# EAGLE schematic esp32-nbiot-xx-v12-wroom32 (EAGLE 7.3.0)
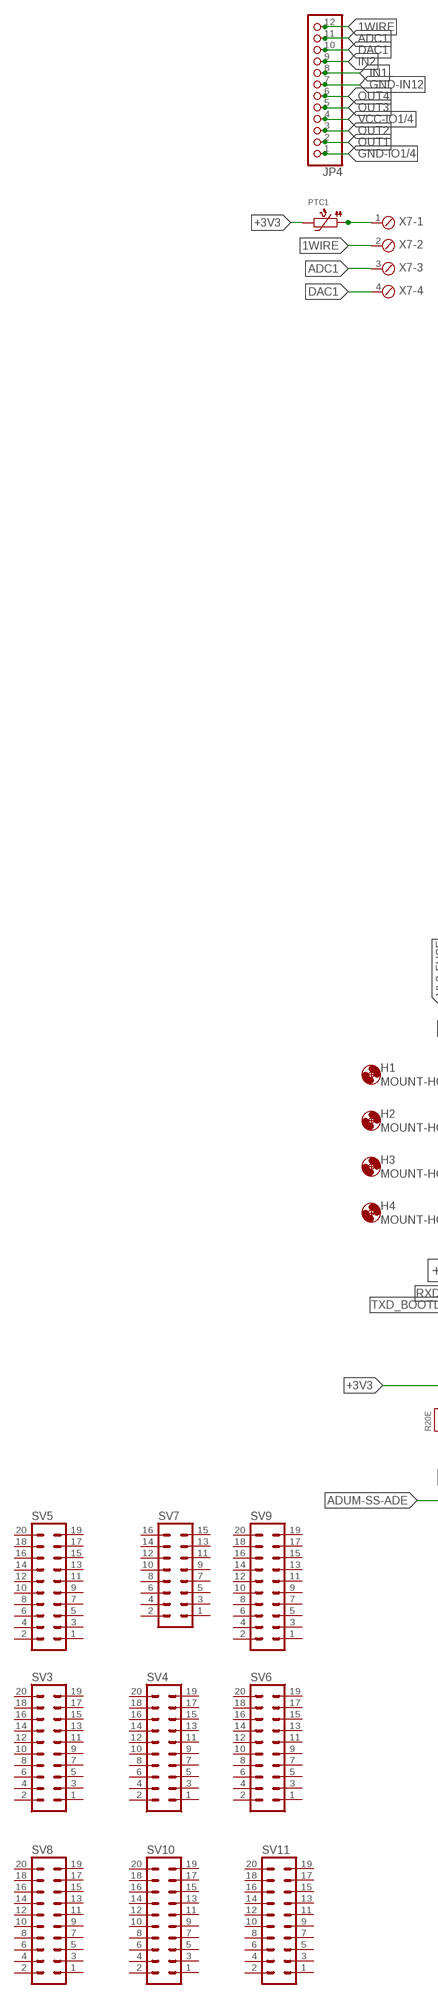
[diagram p0: schematic, sheet 1, part 1 of 3]
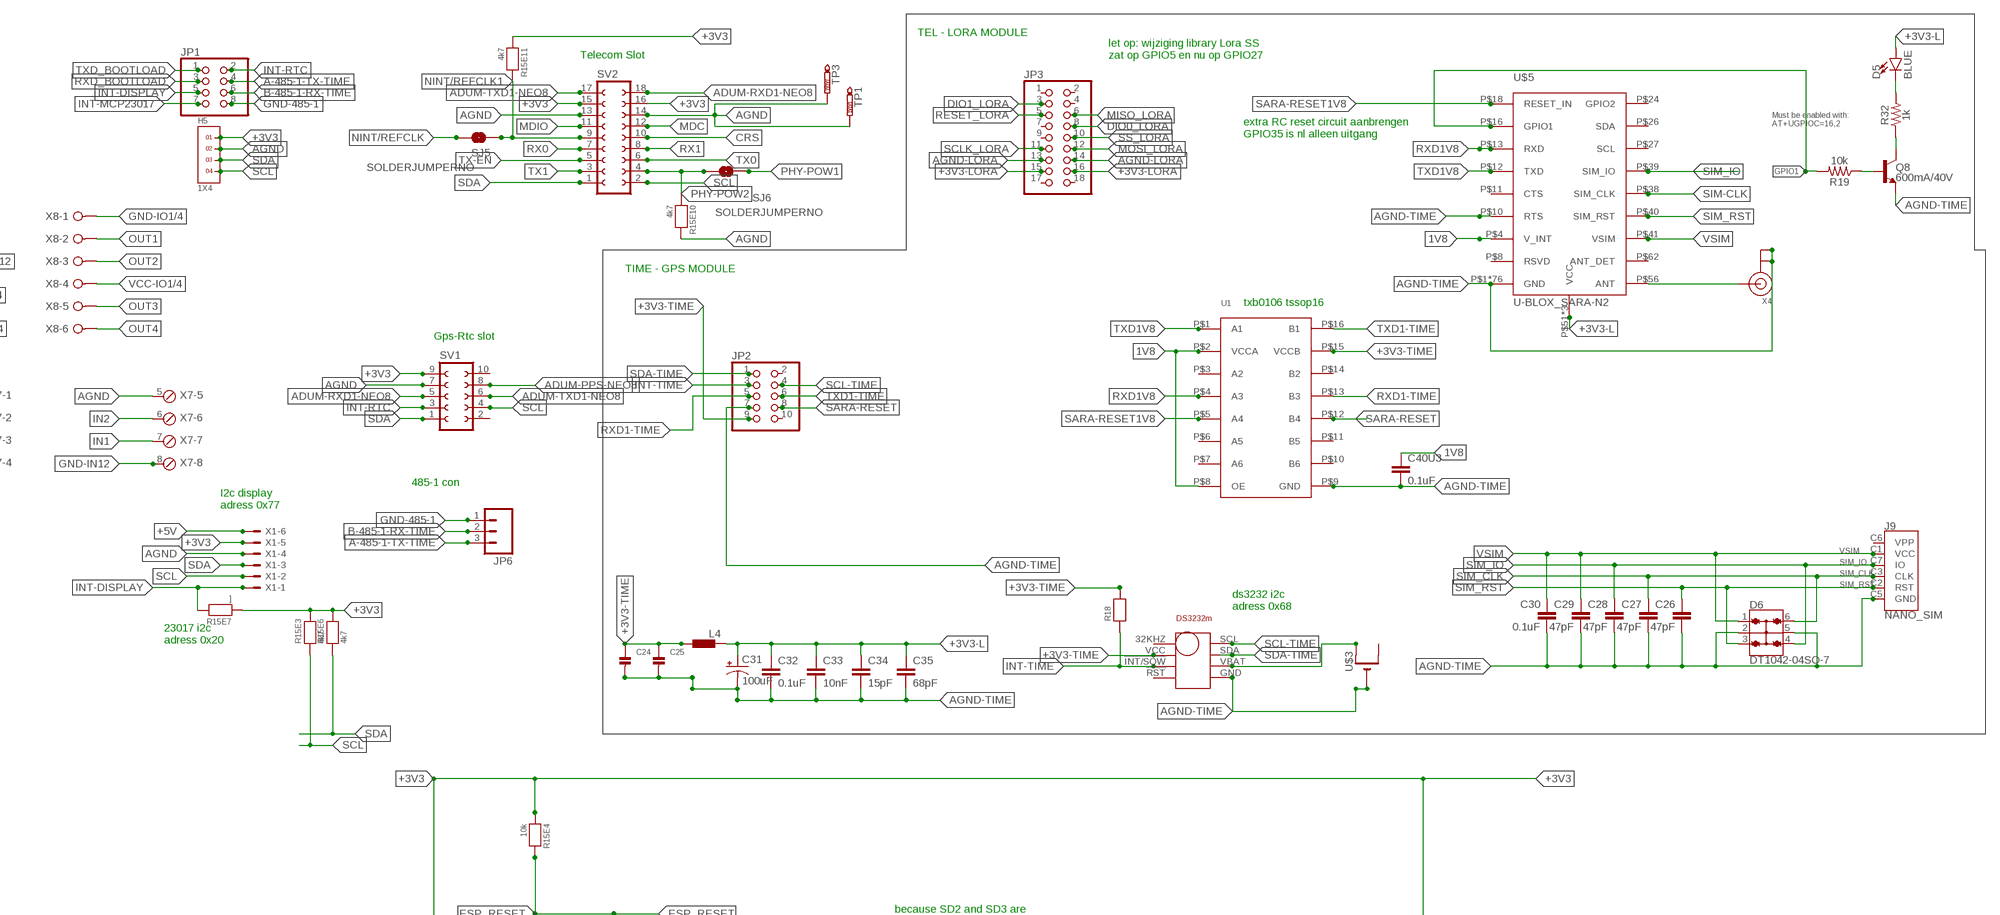
[diagram p1: schematic, sheet 1, part 2 of 3]
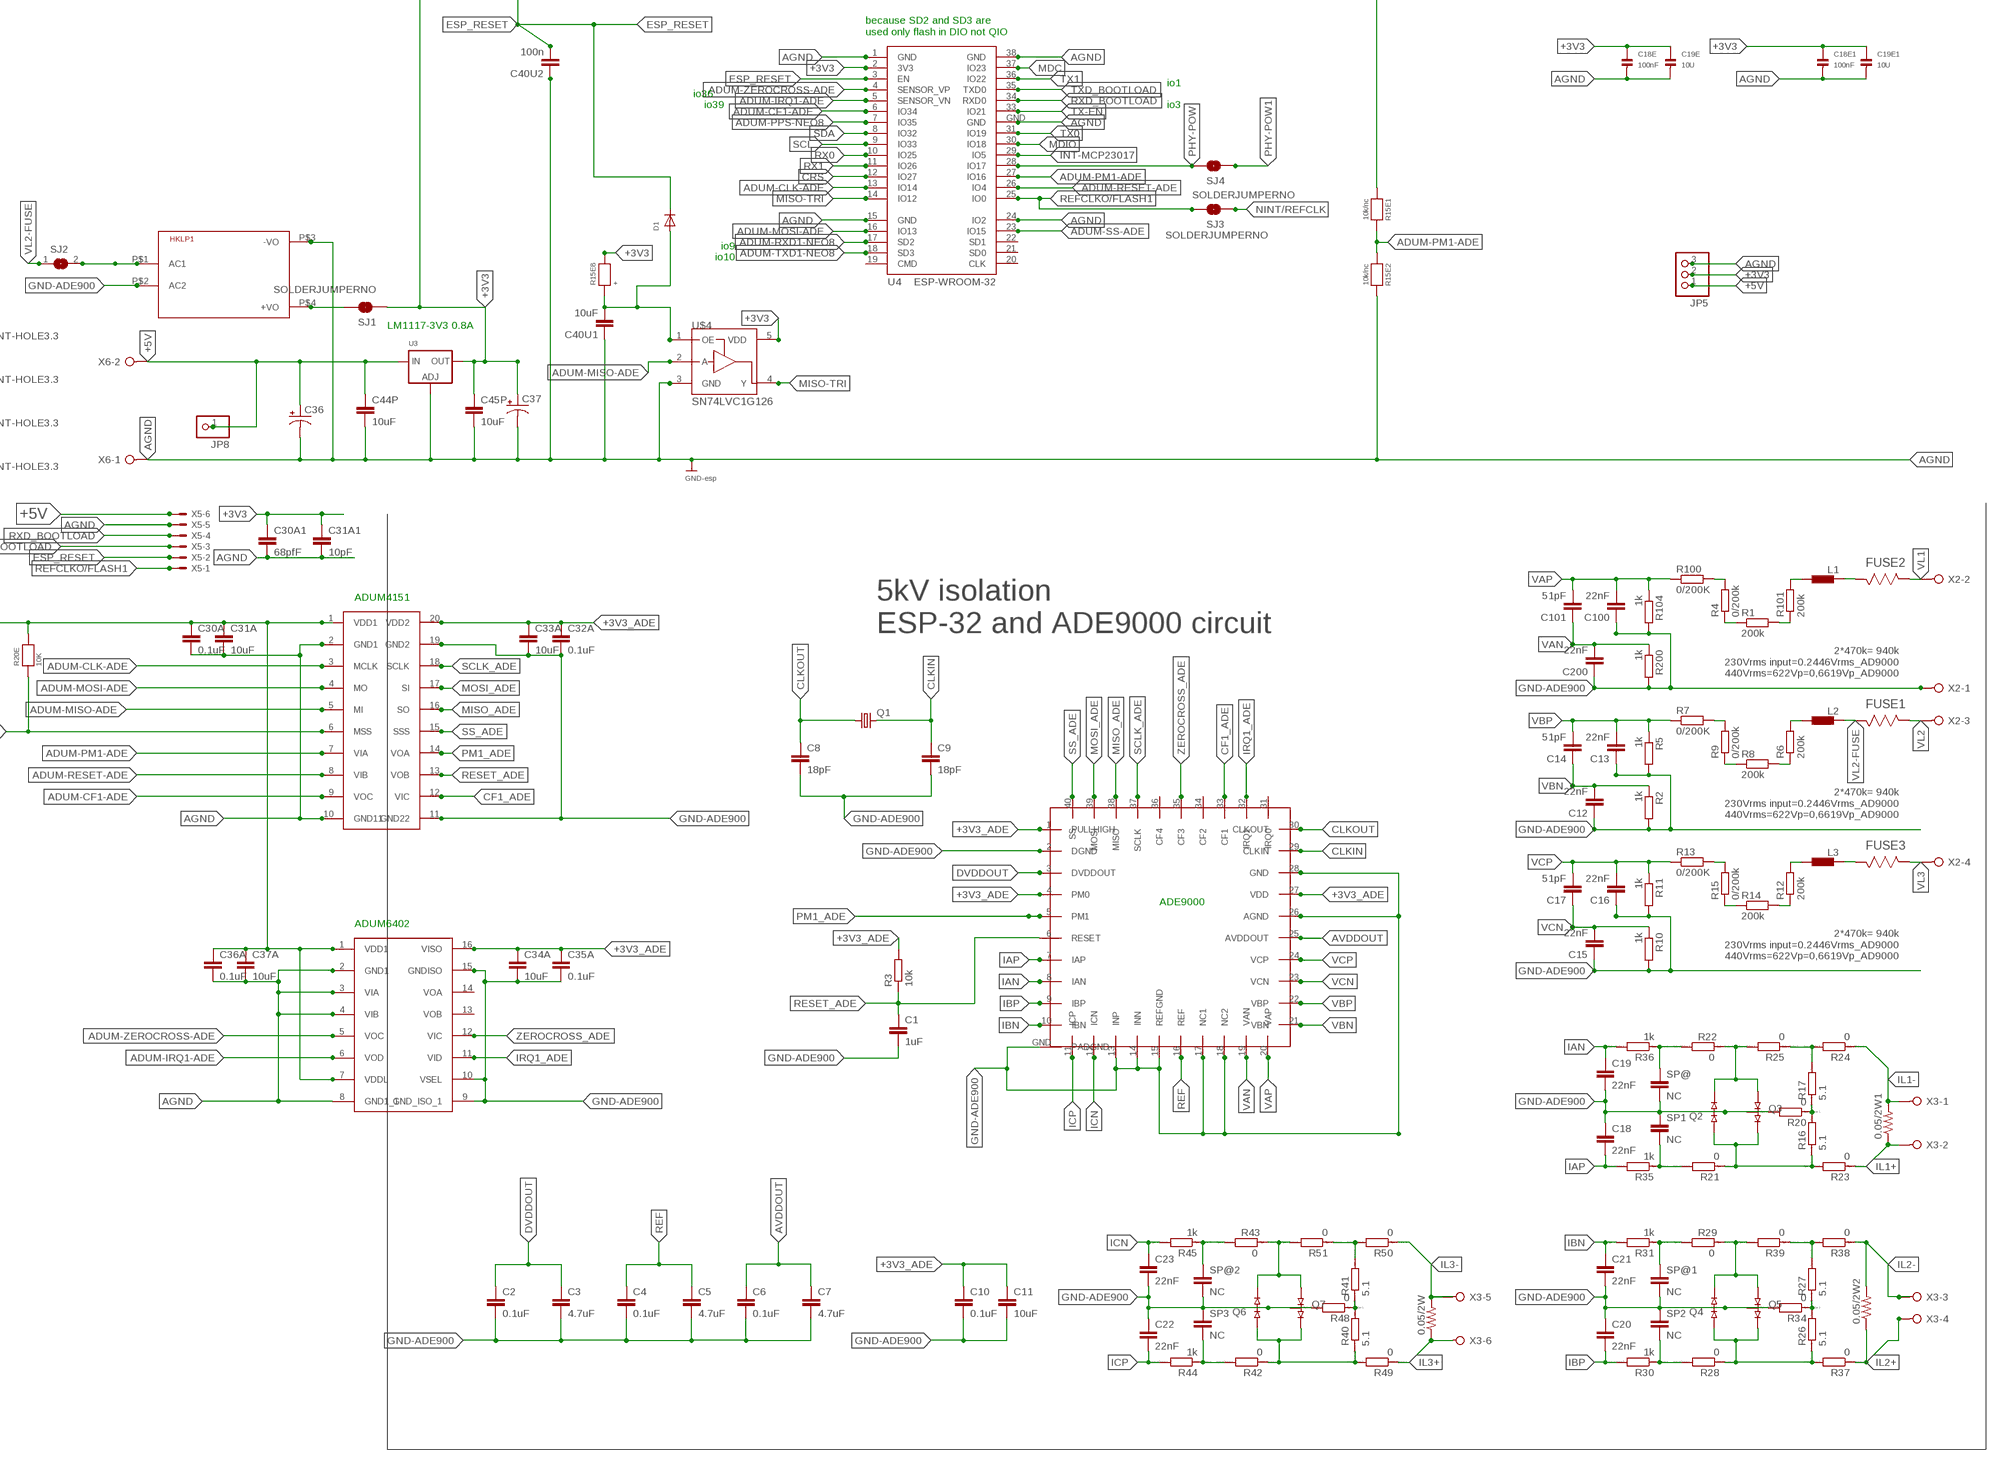
[diagram p2: schematic, sheet 1, part 3 of 3]

## Parts
0.05/2W  R-US_R4527  [R4527]
0.05/2W1  R-US_R4527  [R4527]
0.05/2W2  R-US_R4527  [R4527]
ADE9000  ADE9000  [LFCSP40]
ADUM4151  ADUM4151  [SOIC20R]
ADUM6402-2  ADUM6402  [SOIC16R]
C1  1uF  C-EUC0805  [C0805]
C2  0.1uF  C-EUC0805  [C0805]
C3  4.7uF  C-EUC0805  [C0805]
C4  0.1uF  C-EUC0805  [C0805]
C5  4.7uF  C-EUC0805  [C0805]
C6  0.1uF  C-EUC0805  [C0805]
C7  4.7uF  C-EUC0805  [C0805]
C8  18pF  C-EUC0805  [C0805]
C9  18pF  C-EUC0805  [C0805]
C10  0.1uF  C-EUC0805  [C0805]
C11  10uF  C-EUC0805  [C0805]
C12  22nF  C-EUC0805  [C0805]
C13  22nF  C-EUC0805  [C0805]
C14  51pF  C-EUC0805  [C0805]
C15  22nF  C-EUC0805  [C0805]
C16  22nF  C-EUC0805  [C0805]
C17  51pF  C-EUC0805  [C0805]
C18  22nF  C-EUC0805  [C0805]
C18E  100nF  CAP_CERAMIC_0805  [_0805]
C18E1  100nF  CAP_CERAMIC_0805  [_0805]
C19  22nF  C-EUC0805  [C0805]
C19E  10U  CAP_CERAMIC_0805  [_0805]
C19E1  10U  CAP_CERAMIC_0805  [_0805]
C20  22nF  C-EUC0805  [C0805]
C21  22nF  C-EUC0805  [C0805]
C22  22nF  C-EUC0805  [C0805]
C23  22nF  C-EUC0805  [C0805]
C24  CAP_CERAMIC0805  [0805]
C25  CAP_CERAMIC0805  [0805]
C26  47pF  47PF-0603-50V-5%  [0603]
C27  47pF  47PF-0603-50V-5%  [0603]
C28  47pF  47PF-0603-50V-5%  [0603]
C29  47pF  47PF-0603-50V-5%  [0603]
C30  0.1uF  0.1UF-0603-25V-(+80/-20%)  [0603]
C30A  0.1uF  C-EUC0805  [C0805]
C30A1  68pfF  C-EUC0805  [C0805]
C31  100uF  100UF-POLAR-1206-6.3V-20%  [1206-POLAR]
C31A  10uF  C-EUC0805  [C0805]
C31A1  10pF  C-EUC0805  [C0805]
C32  0.1uF  0.1UF-0603-25V-(+80/-20%)  [0603]
C32A  0.1uF  C-EUC0805  [C0805]
C33  10nF  10NF-0603-50V-10%  [0603]
C33A  10uF  C-EUC0805  [C0805]
C34  15pF  15PF-0603-50V-5%  [0603]
C34A  10uF  C-EUC0805  [C0805]
C35  68pF  68PF-0603-50V-5%  [0603]
C35A  0.1uF  C-EUC0805  [C0805]
C36  CPOL-USD/7343-31R  [D/7343-31R]
C36A  0.1uF  C-EUC0805  [C0805]
C37  CPOL-USD/7343-31R  [D/7343-31R]
C37A  10uF  C-EUC0805  [C0805]
C40U1  10uF  C-EUC0805  [C0805]
C40U2  100n  C-EUC0805  [C0805]
C40U3  0.1uF  C-EUC0805  [C0805]
C44P  10uF  C-EUC0805  [C0805]
C45P  10uF  C-EUC0805  [C0805]
C100  22nF  C-EUC0805  [C0805]
C101  51pF  C-EUC0805  [C0805]
C200  22nF  C-EUC0805  [C0805]
D1  DIODE_SOD-123FL  [SOD-123FL]
D5  BLUE  LED-BLUE0603  [LED-0603]
D6  DT1042-04SO-7  TVS_DIODE_ARRAY_4DT1042-04SO-7  [SOT23-6L]
FUSE1  CRCW25124R70JNEG  [RESC6332X71N]
FUSE2  CRCW25124R70JNEG  [RESC6332X71N]
FUSE3  CRCW25124R70JNEG  [RESC6332X71N]
H1  MOUNT-HOLE3.3  [3,3]
H2  MOUNT-HOLE3.3  [3,3]
H3  MOUNT-HOLE3.3  [3,3]
H4  MOUNT-HOLE3.3  [3,3]
H5  1X4  [1X4]
HKLP1  HKLPM01  [HKLPM01]
J9  NANO_SIM  NANO_SIMWURTH  [NANO_SIM_WURTH_693043020611]
JP1  PINHD-2X4  [2X04]
JP2  PINHD-2X5/90  [2X05/90]
JP3  PINHD-2X9/90  [2X09/90]
JP4  PINHD-1X12  [1X12]
JP5  PINHD-1X3  [1X03]
JP6  M03SCREW  [SCREWTERMINAL-3.5MM-3]
JP8  PINHD-1X1  [1X01]
L1  1500  FERRITE_BEAD0805  [M0805]
L2  1500  FERRITE_BEAD0805  [M0805]
L3  1500  FERRITE_BEAD0805  [M0805]
L4  1500  FERRITE_BEAD0805  [M0805]
PTC1  PTC1206  [1206]
Q1  CRYSTALCTS406  [CTS406]
Q2  MMBD4148SE  DUAL_DIODE_SOT23-3  [SOT23-3]
Q3  MMBD4148SE  DUAL_DIODE_SOT23-3  [SOT23-3]
Q4  MMBD4148SE  DUAL_DIODE_SOT23-3  [SOT23-3]
Q5  MMBD4148SE  DUAL_DIODE_SOT23-3  [SOT23-3]
Q6  MMBD4148SE  DUAL_DIODE_SOT23-3  [SOT23-3]
Q7  MMBD4148SE  DUAL_DIODE_SOT23-3  [SOT23-3]
Q8  600mA/40V  TRANS_NPN-MMBT2222AL  [SOT23-3]
R1  200k  R-EU_M1206  [M1206]
R2  1k  R-EU_M0805  [M0805]
R3  10k  R-EU_M0805  [M0805]
R4  0/200k  R-EU_M1206  [M1206]
R5  1k  R-EU_M0805  [M0805]
R6  200k  R-EU_M1206  [M1206]
R7  0/200K  R-EU_M1206  [M1206]
R8  200k  R-EU_M1206  [M1206]
R9  0/200k  R-EU_M1206  [M1206]
R10  1k  R-EU_M0805  [M0805]
R11  1k  R-EU_M0805  [M0805]
R12  200k  R-EU_M1206  [M1206]
R13  0/200K  R-EU_M1206  [M1206]
R14  200k  R-EU_M1206  [M1206]
R15  0/200k  R-EU_M1206  [M1206]
R15E1  10k/nc  RESISTOR_0805  [_0805]
R15E2  10k/nc  RESISTOR_0805  [_0805]
R15E3  4k7  RESISTOR_0805  [_0805]
R15E4  10k  RESISTOR_0805  [_0805]
R15E6  4k7  RESISTOR_0805  [_0805]
R15E7  ]  RESISTOR_0805  [_0805]
R15E8  +  RESISTOR_0805  [_0805]
R15E10  4k7  RESISTOR_0805  [_0805]
R15E11  4k7  RESISTOR_0805  [_0805]
R16  5.1  R  [R0805]
R17  5.1  R  [R0805]
R18  RESISTOR0805  [0805]
R19  10k  10KOHM-0603-1/10W-1%  [0603]
R20  0  RR0603  [R0603]
R20E  10K  RESISTOR_0805  [_0805]
R21  0  RR0603  [R0603]
R22  0  RR0603  [R0603]
R23  0  RR0603  [R0603]
R24  0  RR0603  [R0603]
R25  0  RR0603  [R0603]
R26  5.1  R  [R0805]
R27  5.1  R  [R0805]
R28  0  RR0603  [R0603]
R29  0  RR0603  [R0603]
R30  1k  RR0603  [R0603]
R31  1k  RR0603  [R0603]
R32  1k  1KOHM-0603-1/10W-1%  [0603]
R34  0  RR0603  [R0603]
R35  1k  RR0603  [R0603]
R36  1k  RR0603  [R0603]
R37  0  RR0603  [R0603]
R38  0  RR0603  [R0603]
R39  0  RR0603  [R0603]
R40  5.1  R  [R0805]
R41  5.1  R  [R0805]
R42  0  RR0603  [R0603]
R43  0  RR0603  [R0603]
R44  1k  RR0603  [R0603]
R45  1k  RR0603  [R0603]
R48  0  RR0603  [R0603]
R49  0  RR0603  [R0603]
R50  0  RR0603  [R0603]
R51  0  RR0603  [R0603]
R100  0/200K  R-EU_M1206  [M1206]
R101  200k  R-EU_M1206  [M1206]
R104  1k  R-EU_M0805  [M0805]
R200  1k  R-EU_M0805  [M0805]
SJ1  SOLDERJUMPERNO  [SJ_2S-NO]
SJ2  SOLDERJUMPERWAVE  [SOLDERJUMPER_WAVE]
SJ3  SOLDERJUMPERNO  [SJ_2S-NO]
SJ4  SOLDERJUMPERNO  [SJ_2S-NO]
SJ5  SOLDERJUMPERNO  [SJ_2S-NO]
SJ6  SOLDERJUMPERNO  [SJ_2S-NO]
SP1  NC  C-EUC0805  [C0805]
SP2  NC  C-EUC0805  [C0805]
SP3  NC  C-EUC0805  [C0805]
SP@  NC  C-EUC0805  [C0805]
SP@1  NC  C-EUC0805  [C0805]
SP@2  NC  C-EUC0805  [C0805]
SV1  FE05-2W  [FE05-2W]
SV2  FE09-2W  [FE09-2W]
SV3  MA10-2  [MA10-2]
SV4  MA10-2  [MA10-2]
SV5  MA10-2  [MA10-2]
SV6  MA10-2  [MA10-2]
SV7  MA08-2  [MA08-2]
SV8  MA10-2  [MA10-2]
SV9  MA10-2  [MA10-2]
SV10  MA10-2  [MA10-2]
SV11  MA10-2  [MA10-2]
TP1  PTR1TP08SQ  [TP08SQ]
TP3  PTR1TP08SQ  [TP08SQ]
U1  TXB0106  [TSSOP16]
U3  LM1117SOT223-REFLOW  [SOT223-R]
U4  ESP-WROOM-32  [ESP-WROOM-32]
U$1  DS3232M  [SOIC8]
U$3  CR1220SMT  [CR1220-SMD]
U$4  SN74LVC1G126DBVT  [SOT-23-5L]
U$5  U-BLOX_SARA-N2  [SARA-N2]
X1  22-23-2061  [22-23-2061]
X2  W237-04P  [W237-4P]
X3  W237-06P  [W237-6P]
X4  ANTENNA_U.FL  [U.FL]
X5  22-23-2061  [22-23-2061]
X6  W237-02P  [W237-132]
X7  MPT8  [8POL254]
X8  W237-06P  [W237-6P]

## Nets
1V8: C40U3.1 U1.P$2(VCCA) U1.P$8(OE) U$5.P$4(V_INT)
1WIRE: JP4.12 X7.2
+3V3: ADUM4151.1(VDD1) ADUM6402-2.1(VDD1) ADUM6402-2.7(VDDL) C18E1.1 C18E.1 C19E1.1 C19E.1 C30A1.1 C30A.1 C31A1.1 C31A.1 C36A.1 C37.+ C37A.1 C45P.1 H5.1 JP5.2 PTC1.2 R15E1.1 R15E3.2 R15E4.1 R15E6.2 R15E7.1 R15E8.2 R15E11.1 R20E.2 SJ1.1 SV1.9 SV2.15 SV2.16 U3.2(OUT) U4.2(3V3) U$4.5(VDD) X1.5
+3V3-L: C31.1(+) C32.1 C33.1 C34.1 C35.1 D5.A L4.1 U$5.P$51(VCC) U$5.P$52(VCC) U$5.P$53(VCC)
+3V3-LORA: JP3.15 JP3.16
+3V3-TIME: C24.1 C25.1 JP2.9 L4.2 R18.2 U1.P$15(VCCB) U$1.VCC
+3V3_ADE: ADE9000.1(PULLHIGH) ADE9000.4(PM0) ADE9000.27(VDD) ADUM4151.20(VDD2) ADUM6402-2.16(VISO) C10.1 C11.1 C32A.1 C33A.1 C34A.1 C35A.1 R3.2
+3V3FUSE: PTC1.1 X7.1
+5V: C36.+ C44P.1 JP5.1 JP8.1 U3.3(IN) X1.6 X5.6 X6.2
A-485-1-TX-TIME: JP1.4 JP6.3
ADC1: JP4.11 X7.3
ADUM-CF1-ADE: ADUM4151.9(VOC) U4.6(IO34)
ADUM-CLK-ADE: ADUM4151.3(MCLK) U4.13(IO14)
ADUM-IRQ1-ADE: ADUM6402-2.6(VOD) U4.5(SENSOR_VN)
ADUM-MISO-ADE: ADUM4151.5(MI) U$4.2(A)
ADUM-MOSI-ADE: ADUM4151.4(MO) U4.16(IO13)
ADUM-PM1-ADE: ADUM4151.7(VIA) R15E1.2 R15E2.1 U4.27(IO16)
ADUM-PPS-NEO8: SV1.8 U4.7(IO35)
ADUM-RESET-ADE: ADUM4151.8(VIB) U4.26(IO4)
ADUM-RXD1-NEO8: SV1.5 SV2.18 U4.17(SD2)
ADUM-SS-ADE: ADUM4151.6(MSS) R20E.1 U4.23(IO15)
ADUM-TXD1-NEO8: SV1.6 SV2.17 U4.18(SD3)
ADUM-ZEROCROSS-ADE: ADUM6402-2.5(VOC) U4.4(SENSOR_VP)
AGND: ADUM4151.2(GND1) ADUM4151.10(GND11) ADUM6402-2.2(GND1) ADUM6402-2.3(VIA) ADUM6402-2.4(VIB) ADUM6402-2.8(GND1_1) C18E1.2 C18E.2 C19E1.2 C19E.2 C30A1.2 C30A.2 C31A1.2 C31A.2 C36.- C36A.2 C37.- C37A.2 C40U1.1 C40U2.1 C44P.2 C45P.2 H5.2 HKLP1.P$3(-VO) JP5.3 R15E2.2 R15E10.2 SV1.7 SV2.13 SV2.14 TP1.TP TP3.TP U3.1(ADJ) U4.1(GND) U4.15(GND) U4.24(IO2) U4.38(GND) U4.GND U$4.3(GND) X1.4 X5.5 X6.1 X7.5 ; supply symbol labelled GND-esp
AGND-LORA: JP3.13 JP3.14
AGND-TIME: C24.2 C25.2 C26.2 C27.2 C28.2 C29.2 C30.2 C31.2(-) C32.2 C33.2 C34.2 C35.2 C40U3.2 D6.2 D6.5 J9.C5(GND) JP2.7 Q8.2(E) U1.P$9(GND) U$1.GND U$3.- U$5.P$1(GND) U$5.P$2(GND) U$5.P$3(GND) U$5.P$5(GND) U$5.P$6(GND) U$5.P$7(GND) U$5.P$9(GND) U$5.P$10(RTS) U$5.P$14(GND) U$5.P$15(GND) U$5.P$17(GND) U$5.P$19(GND) U$5.P$20(GND) U$5.P$21(GND) U$5.P$22(GND) U$5.P$23(GND) U$5.P$25(GND) U$5.P$28(GND) U$5.P$29(GND) U$5.P$30(GND) U$5.P$31(GND) U$5.P$32(GND) U$5.P$33(GND) U$5.P$34(GND) U$5.P$35(GND) U$5.P$36(GND) U$5.P$37(GND) U$5.P$42(GND) U$5.P$43(GND) U$5.P$44(GND) U$5.P$45(GND) U$5.P$46(GND) U$5.P$47(GND) U$5.P$48(GND) U$5.P$49(GND) U$5.P$50(GND) U$5.P$54(GND) U$5.P$55(GND) U$5.P$57(GND) U$5.P$58(GND) U$5.P$59(GND) U$5.P$60(GND) U$5.P$61(GND) U$5.P$63(GND) U$5.P$64(GND) U$5.P$65(GND) U$5.P$66(GND) U$5.P$67(GND) U$5.P$68(GND) U$5.P$69(GND) U$5.P$70(GND) U$5.P$71(GND) U$5.P$72(GND) U$5.P$73(GND) U$5.P$74(GND) U$5.P$75(GND) U$5.P$76(GND) U$5.P$77(GND) U$5.P$78(GND) U$5.P$79(GND) U$5.P$80(GND) U$5.P$81(GND) U$5.P$82(GND) U$5.P$83(GND) U$5.P$84(GND) U$5.P$85(GND) U$5.P$86(GND) U$5.P$87(GND) U$5.P$88(GND) U$5.P$89(GND) U$5.P$90(GND) U$5.P$91(GND) U$5.P$92(GND) U$5.P$93(GND) U$5.P$94(GND) U$5.P$95(GND) U$5.P$96(GND) X4.1(GND) X4.2(GND)
AVDDOUT: ADE9000.25(AVDDOUT) C6.1 C7.1
B-485-1-RX-TIME: JP1.6 JP6.2
CF1_ADE: ADE9000.33(CF1) ADUM4151.12(VIC)
CLKIN: ADE9000.29(CLKIN) C9.1 Q1.3
CLKOUT: ADE9000.30(CLKOUT) C8.1 Q1.1
CRS: SV2.10 U4.12(IO27)
DAC1: JP4.10 X7.4
DIO0_LORA: JP3.8
DIO1_LORA: JP3.3
DVDDOUT: ADE9000.3(DVDDOUT) C2.1 C3.1
ESP_RESET: C40U2.2 D1.C R15E4.2 U4.3(EN) X5.2
GND-485-1: JP1.8 JP6.1
GND-ADE900: ADE9000.2(DGND) ADE9000.13(INP) ADE9000.14(INN) ADE9000.15(REFGND) ADE9000.17(NC1) ADE9000.18(NC2) ADE9000.26(AGND) ADE9000.28(GND) ADE9000.GND(PADGND) ADUM4151.11(GND22) ADUM4151.19(GND2) ADUM6402-2.9(GND_ISO_1) ADUM6402-2.10(VSEL) ADUM6402-2.15(GNDISO) C1.2 C2.2 C3.2 C4.2 C5.2 C6.2 C7.2 C8.2 C9.2 C10.2 C11.2 C12.1 C13.1 C15.1 C16.1 C18.1 C19.2 C20.1 C21.2 C22.1 C23.2 C32A.2 C33A.2 C34A.2 C35A.2 C100.1 C200.1 HKLP1.P$2(AC2) Q2.3 Q3.3 Q4.3 Q5.3 Q6.3 Q7.3 R2.2 R5.2 R10.2 R11.2 R20.2 R34.2 R48.2 R104.2 R200.2 SP1.1 SP2.1 SP3.1 SP@1.2 SP@2.2 SP@.2 X2.1
GND-IN12: JP4.7 X7.8
GND-IO1/4: JP4.1 X8.1
GPIO1: R19.2 U$5.P$16(GPIO1)
IAN: ADE9000.8(IAN) C19.1 R36.2
IAP: ADE9000.7(IAP) C18.2 R35.2
IBN: ADE9000.10(IBN) C21.1 R31.2
IBP: ADE9000.9(IBP) C20.2 R30.2
ICN: ADE9000.12(ICN) C23.1 R45.2
ICP: ADE9000.11(ICP) C22.2 R44.2
IL1+: 0.05/2W1.1 R23.1 X3.2
IL1-: 0.05/2W1.2 R24.1 X3.1
IL2+: 0.05/2W2.1 R37.1 X3.4
IL2-: 0.05/2W2.2 R38.1 X3.3
IL3+: 0.05/2W.1 R49.1 X3.6
IL3-: 0.05/2W.2 R50.1 X3.5
IN1: JP4.8 X7.7
IN2: JP4.9 X7.6
INT-DISPLAY: JP1.5 R15E7.2 X1.1
INT-MCP23017: JP1.7 U4.29(IO5)
INT-RTC: JP1.2 SV1.3
INT-TIME: JP2.3 R18.1 U$1.!INT/!!SQW
IRQ1_ADE: ADE9000.32(IRQ1) ADUM6402-2.11(VID)
MDC: SV2.12 U4.37(IO23)
MDIO: SV2.11 U4.30(IO18)
MISO-TRI: U4.14(IO12) U$4.4(Y)
MISO_ADE: ADE9000.38(MISO) ADUM4151.16(SO)
MISO_LORA: JP3.6
MOSI_ADE: ADE9000.39(MOSI) ADUM4151.17(SI)
MOSI_LORA: JP3.12
N$2: L2.2 R6.2
N$3: Q2.1 Q3.2 R16.1 R21.1 R23.2
N$4: R7.2 R9.2
N$5: R8.1 R9.1
N$6: C40U1.2 D1.A R15E8.1 U$4.1(OE)
N$7: U$1.VBAT U$3.+$1(+)
N$11: R6.1 R8.2
N$12: Q2.2 Q3.1 R22.2 R25.2
N$13: L3.2 R12.2
N$14: FUSE3.1 L3.1
N$15: R13.2 R15.2
N$16: R14.1 R15.1
N$17: R12.1 R14.2
N$18: R22.1 R36.1 SP@.1
N$19: Q8.1(B) R19.1
N$20: R16.2 R17.1 R20.1
N$21: HKLP1.P$1(AC1) SJ2.2
N$25: R17.2 R24.2 R25.1
N$26: Q4.1 Q5.2 R26.1 R28.1 R37.2
N$27: D5.C R32.2
N$28: Q4.2 Q5.1 R29.2 R39.2
N$29: R29.1 R31.1 SP@1.1
N$30: Q8.3(C) R32.1
N$31: U$5.P$56(ANT) X4.3(SIGNAL)
N$32: R28.2 R30.1 SP2.2
N$33: R4.2 R100.2
N$34: R26.2 R27.1 R34.1
N$35: L1.2 R101.2
N$38: R27.2 R38.2 R39.1
N$39: R1.1 R4.1
N$40: R1.2 R101.1
N$41: R21.2 R35.1 SP1.2
N$42: Q6.1 Q7.2 R40.1 R42.1 R49.2
N$43: Q6.2 Q7.1 R43.2 R51.2
N$45: R43.1 R45.1 SP@2.1
N$46: R42.2 R44.1 SP3.2
N$47: R40.2 R41.1 R48.1
N$51: R41.2 R50.2 R51.1
N$90: HKLP1.P$4(+VO) SJ1.2
NINT/REFCLK: SJ3.1 SJ5.2
NINT/REFCLK1: R15E11.2 SJ5.1 SV2.9
OUT1: JP4.2 X8.2
OUT2: JP4.3 X8.3
OUT3: JP4.5 X8.5
OUT4: JP4.6 X8.6
PHY-POW: SJ4.2 U4.28(IO17)
PHY-POW1: SJ4.1 SJ6.1
PHY-POW2: R15E10.1 SJ6.2 SV2.4
PM1_ADE: ADE9000.5(PM1) ADUM4151.14(VOA)
REF: ADE9000.16(REF) C4.1 C5.1
REFCLKO/FLASH1: SJ3.2 U4.25(IO0) X5.1
RESET_ADE: ADE9000.6(RESET) ADUM4151.13(VOB) C1.1 R3.1
RESET_LORA: JP3.5
RX0: SV2.7 U4.10(IO25)
RX1: SV2.8 U4.11(IO26)
RXD1-TIME: JP2.5 U1.P$13(B3)
RXD1V8: U1.P$4(A3) U$5.P$13(RXD)
RXD_BOOTLOAD: JP1.3 U4.34(RXD0) X5.4
SARA-RESET: JP2.8 U1.P$12(B4)
SARA-RESET1V8: U1.P$5(A4) U$5.P$18(RESET_IN)
SCL: H5.4 R15E3.1 SV1.4 SV2.2 U4.9(IO33) X1.2
SCL-TIME: JP2.4 U$1.SCL
SCLK_ADE: ADE9000.37(SCLK) ADUM4151.18(SCLK)
SCLK_LORA: JP3.11
SDA: H5.3 R15E6.1 SV1.1 SV2.1 U4.8(IO32) X1.3
SDA-TIME: JP2.1 U$1.SDA
SIM-CLK: U$5.P$38(SIM_CLK)
SIM_CLK: C27.1 D6.6 J9.C3(CLK)
SIM_IO: C28.1 D6.4 J9.C7(IO) U$5.P$39(SIM_IO)
SIM_RST: C26.1 D6.3 J9.C2(RST) U$5.P$40(SIM_RST)
SS_ADE: ADE9000.40(SS) ADUM4151.15(SSS)
SS_LORA: JP3.10
TX0: SV2.6 U4.31(IO19)
TX1: SV2.3 U4.36(IO22)
TX-EN: SV2.5 U4.33(IO21)
TXD1-TIME: JP2.6 U1.P$16(B1)
TXD1V8: U1.P$1(A1) U$5.P$12(TXD)
TXD_BOOTLOAD: JP1.1 U4.35(TXD0) X5.3
VAN: ADE9000.19(VAN) C101.1 C200.2 R200.1
VAP: ADE9000.20(VAP) C100.2 C101.2 R100.1 R104.1
VBN: ADE9000.21(VBN) C12.2 C14.1 R2.1
VBP: ADE9000.22(VBP) C13.2 C14.2 R5.1 R7.1
VCC-IO1/4: JP4.4 X8.4
VCN: ADE9000.23(VCN) C15.2 C17.1 R10.1
VCP: ADE9000.24(VCP) C16.2 C17.2 R11.1 R13.1
VL1: FUSE2.2 X2.2
VL1-FUSE: FUSE2.1 L1.1
VL2: FUSE1.2 X2.3
VL2-FUSE: FUSE1.1 L2.1 SJ2.1
VL3: FUSE3.2 X2.4
VSIM: C29.1 C30.1 D6.1 J9.C1(VCC) U$5.P$41(VSIM)
ZEROCROSS_ADE: ADE9000.35(CF3) ADUM6402-2.12(VIC)
Unconnected: ADE9000.31(IRQ0) ADE9000.34(CF2) ADE9000.36(CF4) ADUM6402-2.13(VOB) ADUM6402-2.14(VOA) J9.C6(VPP) JP2.2 JP2.10 JP3.1 JP3.2 JP3.4 JP3.7 JP3.9 JP3.17 JP3.18 SV1.2 SV1.10 SV3.1 SV3.2 SV3.3 SV3.4 SV3.5 SV3.6 SV3.7 SV3.8 SV3.9 SV3.10 SV3.11 SV3.12 SV3.13 SV3.14 SV3.15 SV3.16 SV3.17 SV3.18 SV3.19 SV3.20 SV4.1 SV4.2 SV4.3 SV4.4 SV4.5 SV4.6 SV4.7 SV4.8 SV4.9 SV4.10 SV4.11 SV4.12 SV4.13 SV4.14 SV4.15 SV4.16 SV4.17 SV4.18 SV4.19 SV4.20 SV5.1 SV5.2 SV5.3 SV5.4 SV5.5 SV5.6 SV5.7 SV5.8 SV5.9 SV5.10 SV5.11 SV5.12 SV5.13 SV5.14 SV5.15 SV5.16 SV5.17 SV5.18 SV5.19 SV5.20 SV6.1 SV6.2 SV6.3 SV6.4 SV6.5 SV6.6 SV6.7 SV6.8 SV6.9 SV6.10 SV6.11 SV6.12 SV6.13 SV6.14 SV6.15 SV6.16 SV6.17 SV6.18 SV6.19 SV6.20 SV7.1 SV7.2 SV7.3 SV7.4 SV7.5 SV7.6 SV7.7 SV7.8 SV7.9 SV7.10 SV7.11 SV7.12 SV7.13 SV7.14 SV7.15 SV7.16 SV8.1 SV8.2 SV8.3 SV8.4 SV8.5 SV8.6 SV8.7 SV8.8 SV8.9 SV8.10 SV8.11 SV8.12 SV8.13 SV8.14 SV8.15 SV8.16 SV8.17 SV8.18 SV8.19 SV8.20 SV9.1 SV9.2 SV9.3 SV9.4 SV9.5 SV9.6 SV9.7 SV9.8 SV9.9 SV9.10 SV9.11 SV9.12 SV9.13 SV9.14 SV9.15 SV9.16 SV9.17 SV9.18 SV9.19 SV9.20 SV10.1 SV10.2 SV10.3 SV10.4 SV10.5 SV10.6 SV10.7 SV10.8 SV10.9 SV10.10 SV10.11 SV10.12 SV10.13 SV10.14 SV10.15 SV10.16 SV10.17 SV10.18 SV10.19 SV10.20 SV11.1 SV11.2 SV11.3 SV11.4 SV11.5 SV11.6 SV11.7 SV11.8 SV11.9 SV11.10 SV11.11 SV11.12 SV11.13 SV11.14 SV11.15 SV11.16 SV11.17 SV11.18 SV11.19 SV11.20 U1.P$3(A2) U1.P$6(A5) U1.P$7(A6) U1.P$10(B6) U1.P$11(B5) U1.P$14(B2) U4.19(CMD) U4.20(CLK) U4.21(SD0) U4.22(SD1) U$1.32KHZ U$1.!RST U$3.+$2(+1) U$5.P$8(RSVD) U$5.P$11(CTS) U$5.P$24(GPIO2) U$5.P$26(SDA) U$5.P$27(SCL) U$5.P$62(ANT_DET)

## Notes on the sheet
- TEL - LORA MODULE
- Telecom Slot
- let op: wijziging library Lora SS 
  zat op GPIO5 en nu op GPIO27
- Must be enabled with:
  AT+UGPIOC=16,2
- extra RC reset circuit aanbrengen
  GPIO35 is nl alleen uitgang
- TIME - GPS MODULE
- txb0106 tssop16
- Gps-Rtc slot
- 485-1 con
- I2c display
  adress 0x77
- ds3232 i2c
  adress 0x68
- 23017 i2c 
  adress 0x20
- because SD2 and SD3 are 
  used only flash in DIO not QIO
- io1
- io36
- io39 | io3
- io9
- io10
- LM1117-3V3 0.8A
- ADUM4151
- 5kV isolation
  ESP-32 and ADE9000 circuit
- 2*470k= 940k
  230Vrms input=0.2446Vrms_AD9000
  440Vrms=622Vp=0,6619Vp_AD9000
- 2*470k= 940k
  230Vrms input=0.2446Vrms_AD9000
  440Vrms=622Vp=0,6619Vp_AD9000
- ADE9000
- ADUM6402
- 2*470k= 940k
  230Vrms input=0.2446Vrms_AD9000
  440Vrms=622Vp=0,6619Vp_AD9000

## Library data of the parts
0.05/2W 0.05/2W1 0.05/2W2 = resistor:R-US_: RESISTOR, American symbol
ADE9000 = Schematics:ADE9000
ADUM4151 = Schematics:ADUM4151
ADUM6402-2 = ADUM6402:ADUM6402
C1-C23 C30A C30A1 C31A C31A1 C32A C33A C34A C35A C36A C37A C40U1-C40U3 C44P C45P C100 C101 C200 SP1-SP3 SP@ SP@1 SP@2 = Schematics:C-EU: CAPACITOR, European symbol
C18E C18E1 C19E C19E1 C24 C25 = microbuilder:CAP_CERAMIC: Ceramic Capacitors 0402 - 0402 Surface Mount Capacitors 16pF 50V 5% [Digikey: 445-4899-2-ND] 18pF 50V 5% [Digikey: 490-1281-2-ND] 22pF 50V 5% [Digikey: 490-1283-2-ND] 68pF 50V 5% [Digikey: 490-1289-2-ND] 0.1uF 10V 10% [Digikey: 490-1318-2-ND] 1.0uF 6.3V 10% [Digikey: 490-1320-2-ND] 0603 - 0603 Surface Mount Capacitors 16 pF 50V 5% [Digikey: 445-5051-2-ND] 22 pF 50V [Digikey: PCC220ACVTR-ND] 33 pF 50V 5% [Digikey: 490-1415-1-ND] 56pF 50V 5% [Digikey: 490-1421-1-ND] 220pF 50V 5% [Digikey: 445-1285-1-ND] 680 pF 50V 2200 pF 50V 5% C0G [Digikey: 445-1297-1-ND] 5600 pF 100V 5% X7R [Digikey: 478-3711-1-ND] 0.1 µF 25V 10% [Digikey: PCC2277TR-ND] 0.22 µF 16V 10% X7R [Digikey: 445-1318-1-ND] 1.0 µF 25V 10% [Digikey: 445-5146-2-ND] 0603 - RF Specific 3pF 250V +/-0.1pF RF [Digikey: 712-1347-1-ND] 18 pF 250V 5% [Digikey: 478-3505-1-ND or 712-1322-1-ND] 56 pF 250V 5% C0G RF [Digikey: 490-4867-1-ND] 68 pF 250V RF [Digikey: 490-4868-1-ND] 0805 - 0805 Surface Mount Capacitors 220 pF 250V 2% RF Ceramic Capacitor [Digikey: 712-1398-1-ND] 1000 pF 50V 2% NP0 Ceramic Capacitor [Digikey: 478-3760-1-ND] 0.1 µF 25V 10% Ceramic Capacitor [Digikey: PCC1828TR-ND] 1.0 µF 16V 10% Ceramic Capacitor[Digikey: 490-1691-2-ND] 10.0 µF 10V 10% Ceramic Capacitor[Digikey: 709-1228-1-ND] 10.0 uF 16V 10% Ceramic Capacitor [Digikey: 478-5165-2-ND] 47 uF 6.3V 20% Ceramic Capacitor [Digikey: 587-1779-1-ND or 399-5506-1-ND] 1206 - 1206 Surface Mount Capacitors 47uF 10V 20% Ceramic Capacitor [Digikey: 490-5528-1-ND or 399-5508-1-ND or 445-6010-1-ND] 100uF 6.3V -20%, +80% Y5V Ceramic Capacitor (Digikey: 490-4512-1-ND, Mouser: 81-GRM31CF50J107ZE1L)
C26-C29 = SparkFun-Capacitors:47PF: 47pF ceramic capacitors A capacitor is a passive two-terminal electrical component used to store electrical energy temporarily in an electric field.; PROD_ID: CAP-08913
C30 C32 = SparkFun-Capacitors:0.1UF: 0.1µF ceramic capacitors A capacitor is a passive two-terminal electrical component used to store electrical energy temporarily in an electric field.; PROD_ID: CAP-00810
C31 = ublox:100UF-POLAR: 100µF polarized capacitors A capacitor is a passive two-terminal electrical component used to store electrical energy temporarily in an electric field.; PROD_ID: CAP-14093
C33 = SparkFun-Capacitors:10NF: 0.01uF/10nF/10,000pF ceramic capacitors A capacitor is a passive two-terminal electrical component used to store electrical energy temporarily in an electric field. CAP-09321; PROD_ID: CAP-00867
C34 = SparkFun-Capacitors:15PF: 15pF ceramic capacitors A capacitor is a passive two-terminal electrical component used to store electrical energy temporarily in an electric field.; PROD_ID: CAP-07881
C35 = ublox:68PF: 68pF ceramic capacitors A capacitor is a passive two-terminal electrical component used to store electrical energy temporarily in an electric field.; PROD_ID: CAP-14092
C36 C37 = adafruit:CPOL-US: POLARIZED CAPACITOR, American symbol
D1 = adafruit:DIODE: Diode SMADIODE - SMA Surface Mount Package 20V 1A Schottky Diode Digikey: 641-1014-6-ND DO-1N4148 - Through Hole Small Current Diode SOD-123 20V 1 A (.5mV Vf) Schottky Diode - Digikey: MBRX120TPMSCT-ND SOD-323 10V 570mA (.38mV Vf, 3ns) Schottky Diode - Digikey: ZLLS410CT-ND SOD-523 30V 30mA Schottky Diode (RB751S-40TE61) - Digikey: RB751S-40TE61CT-ND SOT23-R/W - SOT23 Package (R = Solder Paste/Reflow Ovens, W = Hand-Soldering) BAT54Film 40V 300mA - Digikey: 497-7162-1-ND
D5 = SparkFun-LED:LED-BLUE: Blue SMD LED Used in manufacturing of various products at SparkFun Packages: 0603 - SMD 0603 package [Product Link] <http://www.digikey.com/product-detail/en/SMLE12BC7TT86/511-1589-2-ND/1641808> 1206 - SMD1206 package [Product Link] <http://www.digikey.com/product-detail/en/lite-on-inc/LTST-C150TBKT/160-1643-1-ND/573584> SparkFun Products: ESP8266 Thing-Dev Board <https://www.sparkfun.com/products/13711> RedBoard <https://www.sparkfun.com/products/12757>; PROD_ID: DIO-08575
D6 = ublox:TVS_DIODE_ARRAY_4; PROD_ID: DIO-14095
FUSE1-FUSE3 = Vishay_By_element14_Batch_1:CRCW25124R70JNEG: RESISTOR, 2512; MPN: CRCW25124R70JNEG; OC_FARNELL: 1571748; OC_NEWARK: 89M6947; SUPPLIER: Vishay; TOLERANCE: ±5%; VALUE: 4.7 Ohm; WATTAGE: 1 W
H1-H4 = holes:MOUNT-HOLE: MOUNTING HOLE with drill center marker
H5 = headers(.1in):1X4
HKLP1 = HKLPM01:HKLPM01
J9 = ublox:NANO_SIM; PROD_ID: CONN-14097
JP1 = adafruit:PINHD-2X4: PIN HEADER
JP2 = pinhead:PINHD-2X5: PIN HEADER
JP3 = pinhead:PINHD-2X9: PIN HEADER
JP4 = adafruit:PINHD-1X12: PIN HEADER
JP5 = adafruit:PINHD-1X3: PIN HEADER
JP6 = SparkFun:M03: Header 3 Standard 3-pin 0.1" header. Use with straight break away headers (SKU : PRT-00116), right angle break away headers (PRT-00553), swiss pins (PRT-00743), machine pins (PRT-00117), and female headers (PRT-00115). Molex polarized connector foot print use with SKU : PRT-08232 with associated crimp pins and housings.
JP8 = adafruit:PINHD-1X1: Pin header 1x1 for 0.1" spacing With round pins
L1-L4 = Inductors:FERRITE_BEAD; DIGIKEY: 490-1048-1-ND
PTC1 = microbuilder:PTC: PTC (Resettable Fuse) 1206 Package 250mA PTC (16V Max, Time-to-Trip: 0.08s) - Digikey: F2110CT-ND 1210 Package 100mA PTC (30V Max, Time-to-Trip: 0.6s) - Digikey: MF-USMF010-2CT-ND 1812 Package 750mA PTC (24V Max, Time-to-Trip: 0.2s) - Digikey: MF-MSMF075/24-2CT-ND
Q1 = Schematics:CRYSTAL: CRYSTAL; OC_FARNELL: unknown; OC_NEWARK: unknown
Q2-Q7 = DIODE_LED:DUAL_DIODE; DIGIKEY: MMBD4148SECT-ND
Q8 = SparkFun-DiscreteSemi:TRANS_NPN: NPN transistor Current controlled devices typically used to amplify current or used as a switch. BC547 - COM-08928 <http://www.sparkfun.com/products/8928> (TO-92 45V 100mA) (1.Collector 2.Base 3.Emitter) 2N3904 - COM-00521 <http://www.sparkfun.com/products/521> (TO-92 40V 200mA) (1.Emitter 2.Base 3.Collector) P2N2222A - COM-12852 <http://www.sparkfun.com/products/12852> (TO-92 40V 600mA) (1.Collector 2.Base 3.Emitter); PROD_ID: TRANS-08049
R1-R15 R100 R101 R104 R200 = Schematics:R-EU_: RESISTOR, European symbol
R15E1-R15E4 R15E6-R15E8 R15E10 R15E11 R18 R20E = microbuilder:RESISTOR: Resistors 0402 - 0402 Surface Mount Package 22 Ohm 1% 1/16W [Digikey: 311-22.0LRTR-ND] 33 Ohm 5% 1/16W 1.0K 5% 1/16W 1.5K 5% 1/16W 2.0K 1% 1/16W 10.0K 1% 1/16W [Digikey: 311-10.0KLRTR-ND] 10.0K 5% 1/16W [Digikey: RMCF0402JT10K0TR-ND] 12.1K 1% 1/16W [Digikey: 311-22.0LRTR-ND] 100.0K 5% 1/16W 0603 - 0603 Surface Mount Package 0 Ohm 1/10 Watt 1% Resistor 15 Ohm 1/10 Watt 1% Resistor 33 Ohm 1/10 Watt 1% Resistor 49.9 Ohm 1/10 Watt 1% Resistor 100 Ohm 1/10 Watt 1% Resistor 150 Ohm 1/10 Watt 1% Resistor 240 Ohm 1/10 Watt 1% Resistor 390 Ohm 1/10 Watt 1% Resistor 560 Ohm 1/10 Watt 1% Resistor 680 Ohm 1/10 Watt 1% Resistor 750 Ohm 1/10 Watt 1% Resistor 1.0K Ohm 1/10 Watt 1% Resistor 1.5K Ohm 1/10 Watt 1% Resistor 2.0K Ohm 1/10 Watt 1% Resistor 2.2K Ohm 1/10 Watt 1% Resistor 3.3K Ohm 1/10 Watt 1% Resistor 4.7K Ohm 1/10 Watt 1% Resistor 10.0K Ohm 1/10 Watt 1% Resistor 12.0K Ohm 1/10 Watt 1% Resistor 12.1K Ohm 1/10 Watt 1% Resistor 20.0K Ohm 1/10 Watt 1% Resistor 33.0K Ohm 1/10 Watt 1% Resistor 100.0K Ohm 1/10 Watt 1% Resistor 0805 - 0805 Surface Mount Package 0 Ohm 1/8 Watt 1% Resistor 33 Ohm 1/8 Watt 1% Resistor 100 Ohm 1/8 Watt 1% Resistor 150 Ohm 1/8 Watt 1% Resistor 200 Ohm 1/8 Watt 1% Resistor 240 Ohm 1/8 Watt 1% Resistor 330 Ohm 1/8 Watt 1% Resistor 390 Ohm 1/8 Watt 1% Resistor 470 Ohm 1/8 Watt 1% Resistor 1.0K Ohm 1/8 Watt 1% Resistor 1.5K Ohm 1/8 Watt 1% Resistor 2.0K Ohm 1/8 Watt 1% Resistor 4.7K Ohm 1/8 Watt 1% Resistor 5.1K Ohm 1/8 Watt 1% Resistor 5.6K Ohm 1/8 Watt 1% Resistor 10.0K Ohm 1/8 Watt 1% Resistor 22.0K Ohm 1/8 Watt 1% Resistor 33.0K Ohm 1/8 Watt 1% Resistor 100K Ohm 1/8 Watt 1% Resistor 1206 - 1206 Surface Mount Package 2012 - 2010 Surface Mount Package 0.11 Ohm 1/2 Watt 1% Resistor - Digikey: RHM.11UCT-ND
R16 R26 R40 = eagle-ltspice:R: RESISTOR, European symbol; DESCRIPTION: RES, 5.1, 0W1, 0%1, 0805-SMT, ROHS; MANUFACTURER: TE Connectivity Passive Product; MFR_PART_NO_#: CPF0805B5R1E1; SPICEMODEL: NONE; SPICEPREFIX: R
R17 R20-R25 R27-R31 R34-R39 R41-R45 R48-R51 = eagle-ltspice:R: RESISTOR, European symbol; SPICEMODEL: NONE; SPICEPREFIX: R
R19 = SparkFun-Resistors:10KOHM: 10kΩ resistor A resistor is a passive two-terminal electrical component that implements electrical resistance as a circuit element. Resistors act to reduce current flow, and, at the same time, act to lower voltage levels within circuits. - Wikipedia; PROD_ID: RES-00824
R32 = SparkFun-Resistors:1KOHM: 1kΩ resistor A resistor is a passive two-terminal electrical component that implements electrical resistance as a circuit element. Resistors act to reduce current flow, and, at the same time, act to lower voltage levels within circuits. - Wikipedia; PROD_ID: RES-07856
SJ1 SJ3-SJ6 = SparkFun-Retired:SOLDERJUMPER: Solder Jumper Standard SMD solder jumper. Used to automate production. Two varients : Normally Open and Normally Closed are the same, but have different paste layers. NC will have a large amount of paste and should jumper during reflow.
SJ2 = microbuilder:SOLDERJUMPER: SMD Solder JUMPER Solder the two pads together to create a connection, or remove the solder to break it. REFLOW - Use this footprint for solder paste and reflow ovens. WAVE - Use this footprint for hand-soldering (larger pads). CLOSED - Has a trace between the two pads to ensure it is closed by default. The trace needs to be cut to disable the jumper, and can be closed again by creating a solder bridge between the two pads.
SV1 = con-lsta:FE05-2W: FEMALE HEADER; OC_FARNELL: unknown; OC_NEWARK: unknown
SV2 = con-lsta:FE09-2W: FEMALE HEADER; OC_FARNELL: unknown; OC_NEWARK: unknown
SV3-SV6 SV8-SV11 = con-lstb:MA10-2: PIN HEADER; OC_FARNELL: unknown; OC_NEWARK: unknown
SV7 = con-lstb:MA08-2: PIN HEADER; OC_FARNELL: unknown; OC_NEWARK: unknown
TP1 TP3 = testpad:PTR1: TEST PIN
U1 = TXB0106:TXB0106: TXB0106 - 6 bit bi-directional level translator. 100 Mbps, Good for general I/O to/from FPGA. Datasheet: http://www.ti.com/lit/ds/symlink/txb0106.pdf Digikey part #: 296-23759-1-ND; AVAILABILITY: Unavailable; DESCRIPTION: 6-Bit Bidirectional Voltage-Level Translator with Auto Direction Sensing and +/-15-kV ESD Protect; MF: Texas Instruments; MP: TXB0106; PACKAGE: TSSOP-16 Texas Instruments; PRICE: None
U3 = microbuilder:LM1117: LM1117 Voltage Regulator LM1117 Adjustable Voltage regulator [Digikey: LM1117IMP-ADJDKR-ND] LM1117 3.3V Voltage regulator [AP1117E33GDIDKR-ND] LM1117 5.0V Voltage regulator [AP1117E50GDIDKR-ND] SOT223-REFLOW - SOT223 package for solder paste/reflow ovens SOT223-WAVE - SOT223 package for hand-soldering (larger pads) Note: For the fixed-voltage regulators, simply set the ADJ pin to GND.
U4 = esp32:ESP-WROOM-32: Espressif Systems ESP-WROOM-32
U$1 = DS3232M:DS3232M
U$3 = adafruit:CR1220: CR1216/CR1220/CR1225 12mm 3V lithium coin cell Great for battery packup. Both SMT and THM holders. Note the THM package has the ground pads on both sides of the PCB so that the masks are the same - this reduces the cost
U$4 = SN74LVC1G126DBVT:SN74LVC1G126DBVT: 1-Bit Buffer w/Tristate Output; AVAILABILITY: Unavailable; DESCRIPTION: Buffer/Line Driver 1-CH Non-Inverting 3-ST CMOS 5-Pin SOT-23 T/R; MF: Texas Instruments; MP: SN74LVC1G126DBVT; PACKAGE: SOT-23-5 Texas Instruments; PRICE: None
U$5 = UBLOX_SARA-N2:U-BLOX_SARA-N2
X1 X5 = con-molex:22-23-2061: .100" (2.54mm) Center Header - 6 Pin; MF: MOLEX; MPN: 22-23-2061; OC_FARNELL: 1462922; OC_NEWARK: 27C1933
X2 = con-wago-508:W237-04P: WAGO SREW CLAMP; OC_FARNELL: unknown; OC_NEWARK: unknown
X3 X8 = con-wago-508:W237-06P: WAGO SREW CLAMP; OC_FARNELL: unknown; OC_NEWARK: unknown
X4 = adafruit:ANTENNA_U.FL: U.FL Antenna Connector
X6 = con-wago-508:W237-02P: WAGO SREW CLAMP; OC_FARNELL: unknown; OC_NEWARK: unknown
X7 = con-phoenix-254:MPT8: PHOENIX CONNECTOR; OC_FARNELL: unknown; OC_NEWARK: unknown